# Altium project Main_PCB.PrjPcb
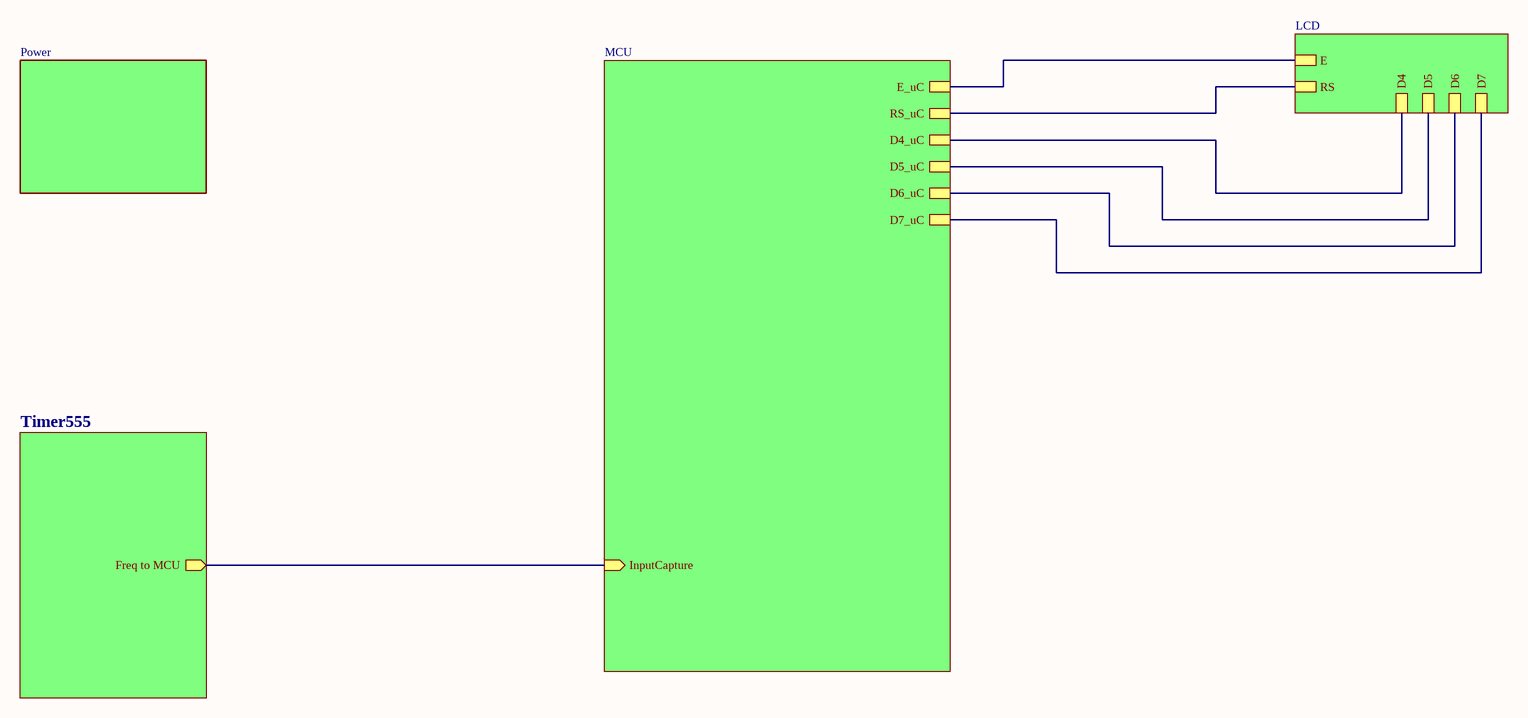
[diagram p0: Main_Board.SchDoc]
4 sheets, 65 parts. Net scope: hierarchical (ports join the sheet entries above them; power ports are global).
Board file: PCB4.PcbDoc
Sheets:
  Main_Board.SchDoc
    Power_D = Power.SchDoc
    Timer555_D = Timer555.SchDoc
    MCU_D = MCU.SchDoc

## Sheet Main_Board.SchDoc
size A3; SheetNumber: 1; SheetTotal: 5

### Sub-sheets
LCD_D = LCD (file not in this document): E, RS, D4, D5, D6, D7
MCU_D = MCU: E_uC, RS_uC, D4_uC, D5_uC, D6_uC, D7_uC, InputCapture (in)
Power_D = Power: no entries
Timer555_D = Timer555: Freq to MCU (out)

### Nets
PA0: sheet Timer555_D/Freq to MCU, sheet MCU_D/InputCapture
PB3: sheet MCU_D/E_uC, sheet LCD_D/E
PB4: sheet MCU_D/RS_uC, sheet LCD_D/RS
PB12: sheet MCU_D/D4_uC, sheet LCD_D/D4
PB13: sheet MCU_D/D5_uC, sheet LCD_D/D5
PB14: sheet MCU_D/D6_uC, sheet LCD_D/D6
PB15: sheet MCU_D/D7_uC, sheet LCD_D/D7

## Sheet Power.SchDoc
size A4; SheetNumber: 2; SheetTotal: 5
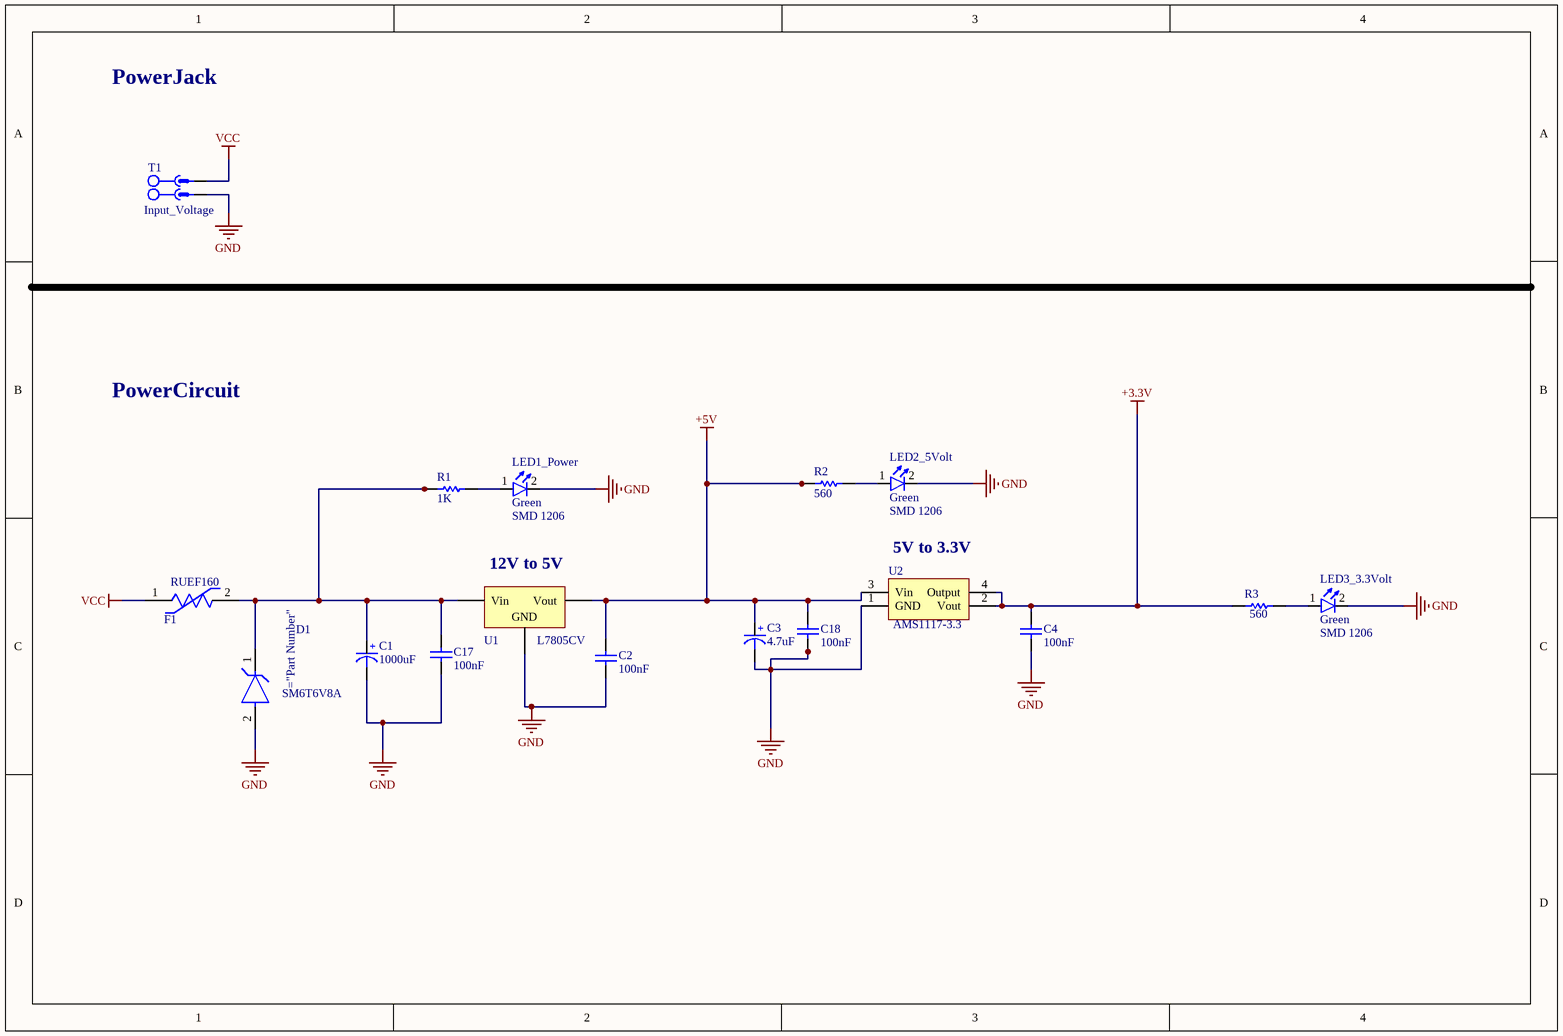
[diagram p1: Power.SchDoc]

### Parts
C1  1000uF  [cap 01]
C2  100nF  [CAPC3216L (1206)]
C3  4.7uF  [cap 01]
C4  100nF  [CAPC3216L (1206)]
C17  100nF  [CAPC3216L (1206)]
C18  100nF  [CAPC3216L (1206)]
D1  SM6T6V8A  [STMicroelectronics_SM6T6V8A_0]
F1  RUEF160  [Littelfuse_RUEF160]
LED1_Power  Size: SMD 1206  [LED SMD 1206]  (hidden comment: Green)
LED2_5Volt  Size: SMD 1206  [LED SMD 1206]  (hidden comment: Green)
LED3_3.3Volt  Size: SMD 1206  [LED SMD 1206]  (hidden comment: Green)
R1  1K  [RESC4817X04N]
R2  560  [RESC4817X04N]
R3  560  [RESC4817X04N]
T1  Input_Voltage  [MSTBV 2,5/2-G-5]
U1  L7805CV  [TO-220 AB]
U2  AMS1117-3.3  [SOT223-4N]

### Nets
+3.3V: C4.1(+) R3.1 U2.2(Vout) U2.4(Output)
+5V: C2.1(+) C3.1(+) C18.1(+) R2.1 U1.3(Vout) U2.3(Vin)
GND: C1.2(-) C2.2(-) C3.2(-) C4.2(-) C17.2(-) C18.2(-) D1.2(A) LED1_Power.2(K) LED2_5Volt.2(K) LED3_3.3Volt.2(K) T1.1 U1.2(GND) U2.1(GND)
VCC: F1.1 T1.2
NetC1_1: C1.1(+) C17.1(+) D1.1(K) F1.2 R1.1 U1.1(Vin)
NetLED1_Power_1: LED1_Power.1(A) R1.2
NetLED2_5Volt_1: LED2_5Volt.1(A) R2.2
NetLED3_3.3Volt_1: LED3_3.3Volt.1(A) R3.2

### Notes on the sheet
- PowerJack
- PowerCircuit
- (near U1) 12V to 5V
- 5V to 3.3V

### Library data of the parts
C1 C3 = CAP_Polar: Polar Capacitor; Designer: Eng. Saeid Jorablo; Company: SJ Libraries; Voltage: 16V; ComponentLink1Description: Datasheet; ComponentLink2Description: Reference; Publisher: SJ Unlimited; Mounting Technology: Surface Mount\Through-Hole; HelpURL: http://s3.picofile.com/file/7443264187/Coming_Soon_logo.gif; Status: Unreleased
  C1: Value: 1000uF
  C3: Value: 4.7uF
C2 C4 C17 C18 = CAP_Bipolar: Bipolar Capacitor; Voltage: 100V; Designer: Eng. Saeid Jorablo; Company: SJ Libraries; ComponentLink1Description: Datasheet; ComponentLink2Description: Reference; Publisher: SJ Unlimited; Mounting Technology: *; Mounting Technology: Surface Mount\Through-Hole; HelpURL: http://s3.picofile.com/file/7443264187/Coming_Soon_logo.gif; Status: Unreleased; Value: 100nF
D1 = SM6T6V8A: TVS DIODE 5.8VWM 13.4VC SMB
F1 = RUEF160: Littelfuse RUEF160----PTC Resettable Fuse 1.6A(hold) 3.2A(trip) 30V 100A 0.9W 8s 0.03Ohm Radial 8.9 X 3 X 15.2mm Bag
LED1_Power LED2_5Volt LED3_3.3Volt = LED: Designer: Saeid Jorablo; Organazation: ControTec; Adding Date: 1387/12/22; Color: Green
R1-R3 = RES 1206 0.25W: RES 1206; Designer: Abbas Basereh; Desc.: RES SMD 1206; Data: 16-12-2016
T1 = CON_Phoenix_MSTBV_02: 2 Pitch: 5 mm Color: green Contact surface: Tin Assembly; Manufacturer: PHOENIX CONTACT; PART.NO: 1753437; Connector type: PCB Terminal Block; designer: ABBAS BASEREH; Max Current: 12 A; Positions: 2; Voltage: 320 V; Category: Connector; ComponentLink1Description: Header, Nominal current: 12 A Rated voltage (III/2): 320 V Number of positions: 2 Pitch: 5 mm Color: green Contact surface: Tin Assembly: Soldering  DESIGNER:ABBAS BASEREH; ComponentLink2Description: Reference; Mounting Technology: Through-Hole; Pin Count: 2; Revision 1: 2017-3-1; Status: Unreleased
U1 = L7805CV-Linear Voltage Regulator IC Positive 1 Output 5V 1.5A TO-220AB: Linear Voltage Regulator IC Positive FIXED; Manufacturer: STMicroelectronics; Designer: Abbas Basereh; Link: https://www.aliexpress.com/item/; Link: http://www.tme.eu/en/; Link: http://www.digikey.com/; Part. No: L7805CV
U2 = IC_AMS1117-3.3: 800mA LOW DROPOUT VOLTAGE REGULATOR; Manufacturer: Advanced Monolithic Systems, Inc.; Company: SJ Libraries; Designer: Eng. Saeid Jorablo; ESD Sensetive: True/False; Code_IPC: SOT-223; ComponentLink1Description: Datasheet; ComponentLink1URL: http://www.advanced-monolithic.com/pdf/ds1117.pdf; ComponentLink2Description: Reference; ComponentLink2URL: http://www.advanced-monolithic.com/index.html; PackageDescription: SOT223, 4-Leads, Body 6.7x7.3mm (max), Pitch 2.30mm; PinCount: 4; Update: 6/5/2012; Category: Integrated Circuit; Status: Unrelease; HelpURL: http://s3.picofile.com/file/7443264187/Coming_Soon_logo.gif; Operating Temperature: -55 ~ +125 (C); Mounting Technology: Surface Mount; RoHS compliant: True/False

## Sheet Timer555.SchDoc
size A4; SheetNumber: 3; SheetTotal: 5
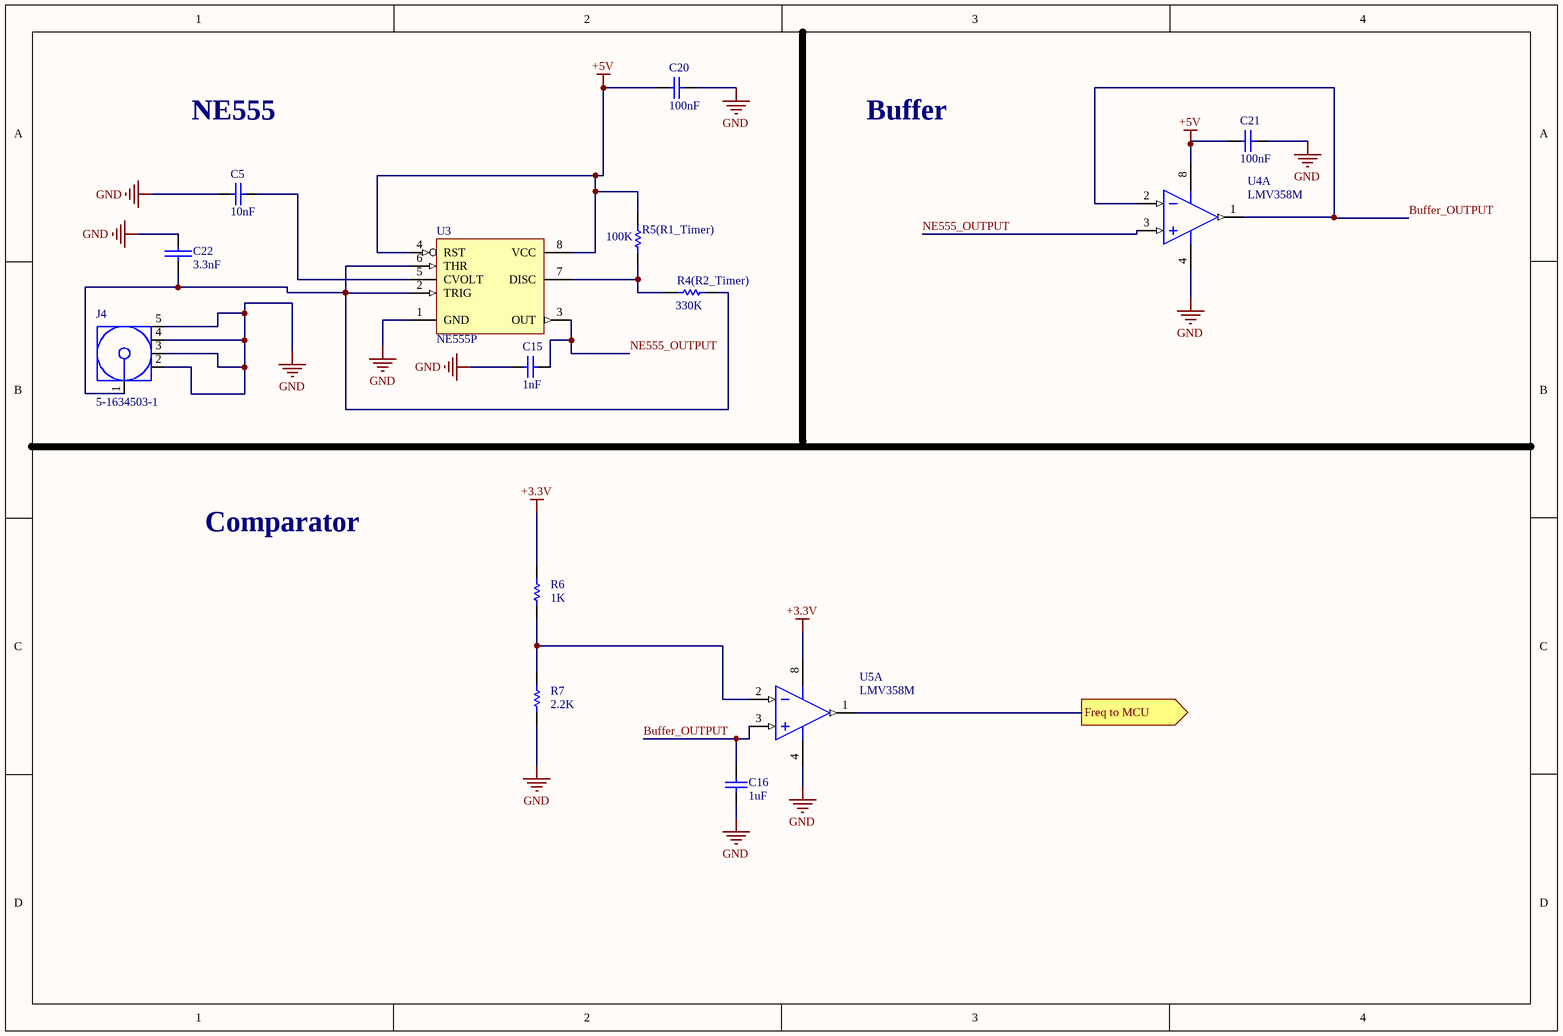
[diagram p2: Timer555.SchDoc]

### Parts
C5  10nF  [CAPC2012N (0805)]
C15  1nF  [CAPC3216M (1206)]
C16  1uF  [CAPC3216M (1206)]
C20  100nF  [CAPC2012N (0805)]
C21  100nF  [CAPC2012N (0805)]
C22  3.3nF  [Cap - 100nF]
J4  5-1634503-1  [TECO-5-1634503-1_V]
R4(R2_Timer)  330K  [Res-(1/2)]
R5(R1_Timer)  100K  [Res-(1/2)]
R6  1K  [RESC3216X60L (1206)]
R7  2.2K  [RESC3216X60L (1206)]
U3  NE555P  [P008]
U4  LMV358M  [M08A_M]  (part A of 2)
U5  LMV358M  [M08A_M]  (part A of 2)

### Ports
Freq to MCU (out)

### Nets
+3.3V: R6.2 U5.8(V+)
+5V: C20.1(+) C21.1(+) R5(R1_Timer).2 U3.4(RST) U3.8(VCC) U4.8(V+)
GND: C5.1(+) C15.1(+) C16.2(-) C20.2(-) C21.2(-) C22.1(+) J4.2 J4.3 J4.4 J4.5 R7.1 U3.1(GND) U4.4(V-) U5.4(V-)
Buffer_OUTPUT: C16.1(+) U4.1(OUTA) U4.2(INA-) U5.3(INA+)
NE555_OUTPUT: C15.2(-) U3.3(OUT) U4.3(INA+)
PA0: U5.1(OUTA) ; port Freq to MCU
NetC5_2: C5.2(-) U3.5(CVOLT)
NetC22_2: C22.2(-) J4.1 R4(R2_Timer).2 U3.2(TRIG) U3.6(THR)
NetR4(R2_Timer)_1: R4(R2_Timer).1 R5(R1_Timer).1 U3.7(DISC)
NetR6_1: R6.1 R7.2 U5.2(INA-)

### Notes on the sheet
- NE555
- Buffer
- Comparator

### Library data of the parts
C5 C15 C16 C20 C21 = CAP_Bipolar: as C2 on sheet Power; ComponentLink1Description: Datasheet; ComponentLink2Description: Reference; Publisher: SJ Unlimited; Mounting Technology: *; Mounting Technology: Surface Mount\Through-Hole; HelpURL: http://s3.picofile.com/file/7443264187/Coming_Soon_logo.gif; Status: Unreleased
  C5: Value: 10nF
  C15: Value: 1nF
  C16: Value: 1uF
  C20 C21: Value: 100nF
C22 = Cap-Bipolar: Bipolar Capacitor; Voltage: 100V; Designer: Saeid Jorablo; Organazation: ControTec; Adding Date: 1387/12/20; Value: 3.3nF
J4 = 5-1634503-1: Female Header, Pitch 3.13 mm, Height 13.7 mm, Tail Length 4.5 mm, -55 to 85 degC, RoHS, Bulk; Manufacturer: TE Connectivity; Coaxial Termination: Solder; Frequency Max: 2GHz; Connector Type: BNCCoaxial; SVHC: NoSVHC(15-Jun-2015); Connector Body Style: StraightJack; Impedance: 50ohm; Connector Mounting: PCBMount; Manufacturer URL: http://www.te.com/; Coaxial Cable Types: -; Datasheet Version: Rev. E, 02/2012; Datasheet URL: http://www.mouser.com/ds/2/418/NG_CD_1634503_E-657474.pdf; Product Range: -; Contact Plating: GoldPlatedContacts; Mounting Technology: ThroughHole; Contact Material: Brass; Package Description: Female Header, Pitch 3.13 mm, Height 13.7 mm, Tail Length 4.5 mm; Package Reference: 5-1634503-1; PartNumber: 5-1634503-1
R4(R2_Timer) R5(R1_Timer) R7 = RES: Resistor; Designer: Eng. Saeid Jorablo; Company: SJ Libraries; Tolerance: 5%; Power: 1/8 W; Value: 1K; Category: Resistors; ComponentLink1Description: Datasheet; ComponentLink2Description: Reference; PackageDescription: SMD & TH Resistors; Publisher: SJ Unlimited; Mounting Technology: Surface Mount\Through-Hole; HelpURL: http://s3.picofile.com/file/7443264187/Coming_Soon_logo.gif; Status: Unreleased
R6 = RES: Resistor; Designer: Eng. Saeid Jorablo; Company: SJ Libraries; Tolerance: 5%; Power: 1/8 W; Category: Resistors; ComponentLink1Description: Datasheet; ComponentLink2Description: Reference; PackageDescription: SMD & TH Resistors; Publisher: SJ Unlimited; Mounting Technology: Surface Mount\Through-Hole; HelpURL: http://s3.picofile.com/file/7443264187/Coming_Soon_logo.gif; Status: Unreleased; Value: 1K
U3 = NE555P: Precision Timer; Published: 16-Jan-2001; LatestRevisionDate: 04-Mar-2005; LatestRevisionNote: Stylized 3D Model Added.; DatasheetVersion: Feb-1992; PackageVersion: Jun-1999; PackageReference: P008; Publisher: Altium Limited; PackageDescription: DIP; 8 Leads; Row Spacing 7.62 mm; Pitch 2.54 mm; Code_JEDEC: MO-001-AN; ComponentLink1Description: Manufacturer Link; ComponentLink1URL: http://www.ti.com/; ComponentLink2Description: Datasheet; ComponentLink2URL: http://www-s.ti.com/sc/ds/ne555.pdf
U4 U5 = LMV358M: General Purpose, Low Voltage, Rail-to-Rail Output Operational Amplifiers, 8-pin Narrow SOIC; Manufacturer: National Semiconductor; PackageTopMarking: NSZXTT*LMV*358M; PowerWise: N; PinCount: 8; DatasheetVersion: Sep-2009; Code_JEDEC: MS-012-AA; Code_IPC: SOIC127P600-8; PackageVersion: revM, May-2009; PackageReference: M08A; PackageDescription: SOIC Narrow, 4.9 x 3.9 x 1.45mm, 8 Lead, 1.27mm Pitch; CompType: Amplifiers; RoHS: N; PartNumber: LMV358M

## Sheet MCU.SchDoc
size A3; SheetNumber: 4; SheetTotal: 5
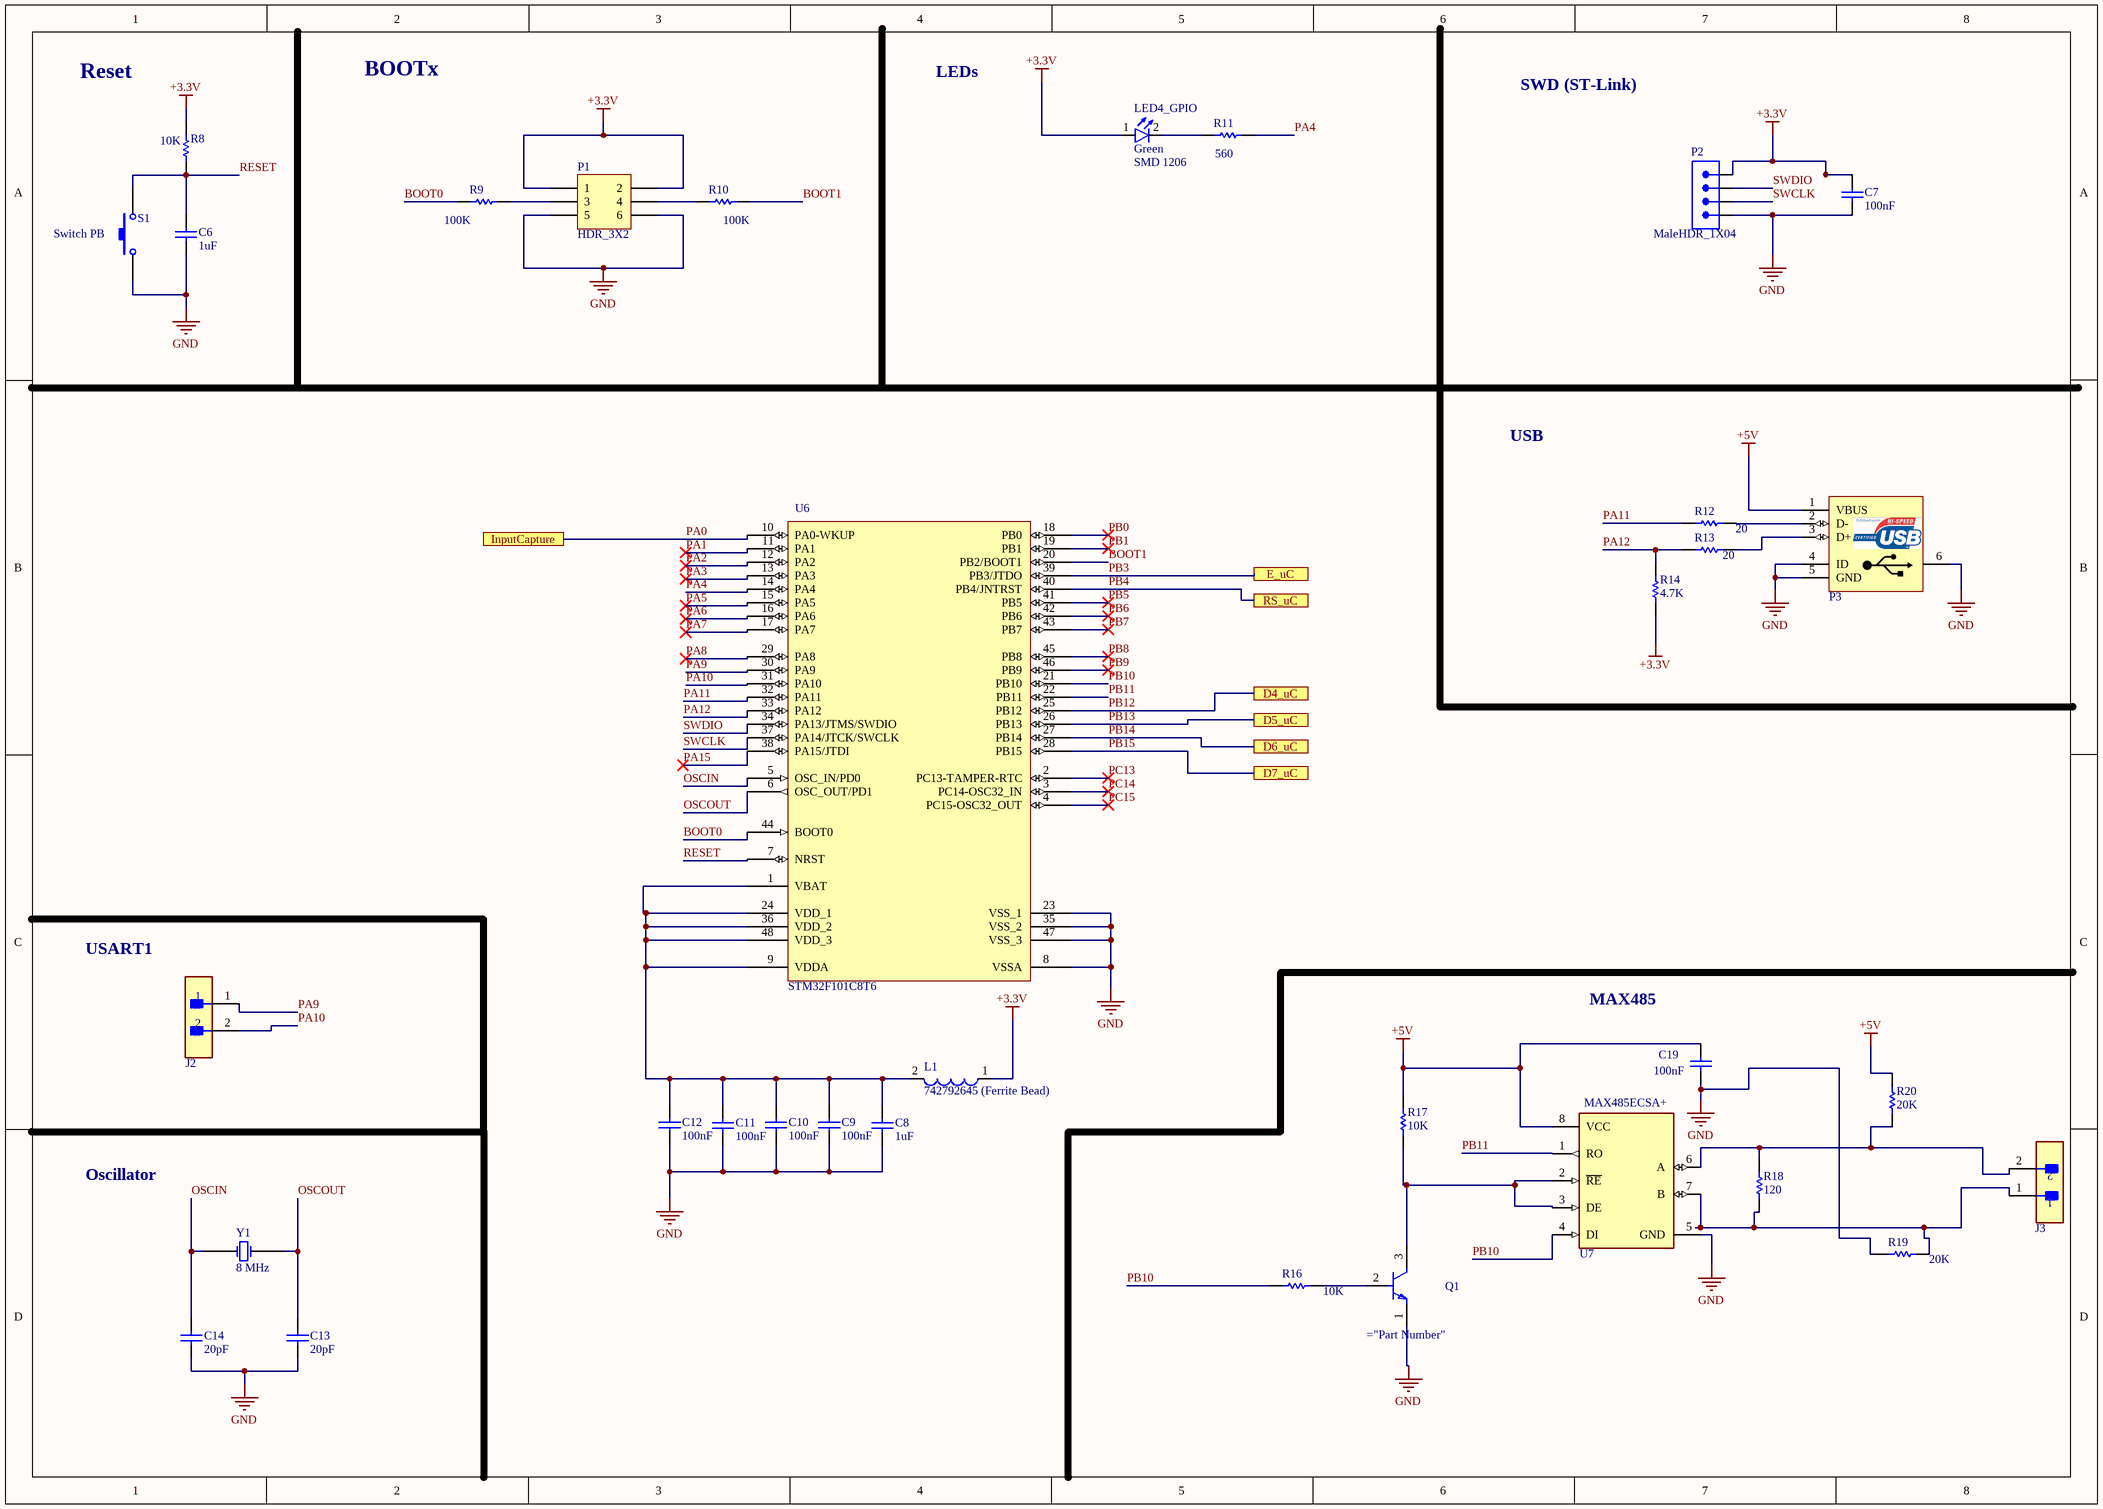
[diagram p3: MCU.SchDoc]

### Parts
C6  1uF  [CAPC3216L (1206)]
C7  100nF  [CAPC3216L (1206)]
C8  1uF  [Cap - 100nF]
C9  100nF  [CAPC3216M (1206)]
C10  100nF  [CAPC3216M (1206)]
C11  100nF  [CAPC3216M (1206)]
C12  100nF  [CAPC3216M (1206)]
C13  20pF  [CAPC1608M (0603)]
C14  20pF  [CAPC1608M (0603)]
C19  100nF  [CAPC3216M (1206)]
J2  B2B-XH-A_LF_SN  [JST_0_MFG]  (value not drawn)
J3  B2B-XH-A_LF_SN  [JST_0_MFG]  (value not drawn)
L1  742792645 (Ferrite Bead)  [SMD-0603]
LED4_GPIO  Size: SMD 1206  [LED SMD 1206]  (hidden comment: Green)
P1  HDR_3X2  [MISC_HDR_2X3]
P2  MaleHDR_1X04  [MHDR1X04-254P]
P3  USB Connector  [USB_AB_BM_SHS]  (value not drawn)
Q1  2N3904TF  [ON_Semiconductor_135AR_MFG]  (value not drawn)
R8  10K  [RESC3216X60L (1206)]
R9  100K  [RESC3216X60M (1206)]
R10  100K  [RESC3216X60M (1206)]
R11  560  [RESC3216X60M (1206)]
R12  20  [RESC3216X60M (1206)]
R13  20  [RESC3216X60M (1206)]
R14  4.7K  [RESC3216X60M (1206)]
R16  10K  [RESC3216X60M (1206)]
R17  10K  [RESC3216X60M (1206)]
R18  120  [RESC3216X60M (1206)]
R19  20K  [RESC3216X60M (1206)]
R20  20K  [RESC3216X60M (1206)]
S1  Switch PB  [Switch - Push to On]
U6  STM32F101C8T6  [LQFP48_L]
U7  MAX485ECSA+  [Maxim_Integrated_S8-5_MFG]
Y1  8 MHz  [Crystal SMD]

### Ports
D4_uC, D5_uC, D6_uC, D7_uC, E_uC, InputCapture, RS_uC

### Nets
+3.3V: C7.1(+) L1.1 LED4_GPIO.1(A) P1.1 P1.2 P2.4 R8.2 R14.1
+5V: C19.2(-) P3.1(VBUS) R17.2 R20.2 U7.8(VCC)
GND: C6.2(-) C7.2(-) C8.2(-) C9.2(-) C10.2(-) C11.2(-) C12.2(-) C13.2(-) C14.2(-) C19.1(+) P1.5 P1.6 P2.1 P3.4(ID) P3.5(GND) P3.6(MH) Q1.1(E) R19.1 S1.1 U6.8(VSSA) U6.23(VSS_1) U6.35(VSS_2) U6.47(VSS_3) U7.5(GND)
BOOT0: R9.1 U6.44(BOOT0)
BOOT1: R10.2 U6.20(PB2/BOOT1)
OSCIN: C14.1(+) U6.5(OSC_IN/PD0) Y1.1(OSC1)
OSCOUT: C13.1(+) U6.6(OSC_OUT/PD1) Y1.2(OSC2)
PA0: U6.10(PA0-WKUP) ; port InputCapture
PA1: U6.11(PA1)
PA2: U6.12(PA2)
PA3: U6.13(PA3)
PA4: R11.2 U6.14(PA4)
PA5: U6.15(PA5)
PA6: U6.16(PA6)
PA7: U6.17(PA7)
PA8: U6.29(PA8)
PA9: J2.1 U6.30(PA9)
PA10: J2.2 U6.31(PA10)
PA11: R12.1 U6.32(PA11)
PA12: R13.1 R14.2 U6.33(PA12)
PA15: U6.38(PA15/JTDI)
PB0: U6.18(PB0)
PB1: U6.19(PB1)
PB3: U6.39(PB3/JTDO) ; port E_uC
PB4: U6.40(PB4/JNTRST) ; port RS_uC
PB5: U6.41(PB5)
PB6: U6.42(PB6)
PB7: U6.43(PB7)
PB8: U6.45(PB8)
PB9: U6.46(PB9)
PB10: R16.1 U6.21(PB10) U7.4(DI)
PB11: U6.22(PB11) U7.1(RO)
PB12: U6.25(PB12) ; port D4_uC
PB13: U6.26(PB13) ; port D5_uC
PB14: U6.27(PB14) ; port D6_uC
PB15: U6.28(PB15) ; port D7_uC
PC13: U6.2(PC13-TAMPER-RTC)
PC14: U6.3(PC14-OSC32_IN)
PC15: U6.4(PC15-OSC32_OUT)
RESET: C6.1(+) R8.1 S1.2 U6.7(NRST)
SWCLK: P2.2 U6.37(PA14/JTCK/SWCLK)
SWDIO: P2.3 U6.34(PA13/JTMS/SWDIO)
NetC8_1: C8.1(+) C9.1(+) C10.1(+) C11.1(+) C12.1(+) L1.2 U6.1(VBAT) U6.9(VDDA) U6.24(VDD_1) U6.36(VDD_2) U6.48(VDD_3)
NetJ3_1: J3.1 R18.1 R19.2 U7.7(B)
NetJ3_2: J3.2 R18.2 R20.1 U7.6(A)
NetLED4_GPIO_2: LED4_GPIO.2(K) R11.1
NetP1_3: P1.3 R9.2
NetP1_4: P1.4 R10.1
NetP3_2: P3.2(D-) R12.2
NetP3_3: P3.3(D+) R13.2
NetQ1_2: Q1.2(B) R16.2
NetQ1_3: Q1.3(C) R17.1 U7.2(~{RE}) U7.3(DE)

### Notes on the sheet
- Reset
- BOOTx
- LEDs
- SWD (ST-Link)
- USB
- USART1
- MAX485
- Oscillator
- (in symbol USB AB MICRO CONNECTOR) D:AbbasBasereh

### Library data of the parts
C6-C14 C19 = CAP_Bipolar: as C2 on sheet Power; ComponentLink1Description: Datasheet; ComponentLink2Description: Reference; Publisher: SJ Unlimited; Mounting Technology: *; Mounting Technology: Surface Mount\Through-Hole; HelpURL: http://s3.picofile.com/file/7443264187/Coming_Soon_logo.gif; Status: Unreleased
  C6 C8: Value: 1uF
  C7 C9-C12 C19: Value: 100nF
  C13 C14: Value: 20pF
L1 = 742792645: SMD EMI Suppression Ferrite Bead WE-CBF, Z = 470 Ohm; Impedance: 470 Ohm; DatasheetVersion: ver 1, Aug-2009; PackageVersion: 2009; PackageReference: SMD-0603; PackageDescription: Chip Inductor, 2-Leads, Body 1.6 x 0.8 mm; ComponentLink1Description: Manufacturer URL; ComponentLink1URL: http://www.we-online.com; ComponentLink2Description: Datasheet; ComponentLink2URL: http://www.we-online.de/katalog/media/pdf/742792645.pdf
LED4_GPIO = LED: as LED1_Power on sheet Power; Adding Date: 1387/12/22; Color: Green
P1 = HDR_3X2: Header, 3-Pin, Dual row; designer: Eng. Saeid Jorablo; Company: SJ Libraries; Max Current: mA; LatestRevisionDate: 17-Jul-2002; Publisher: SJ UnLimited; Mounting Technology: Through-Hole; Category: Headers; Pin Count: 6; Status: Unreleased; ComponentLink1Description: Datasheet; ComponentLink2Description: Reference; Update: 7/8/2012; HelpURL: http://s3.picofile.com/file/7443264187/Coming_Soon_logo.gif
P2 = MHDR_1X04: Male Header 1X04
P3 = USB AB MICRO CONNECTOR: USB MICRO-B Type Connector; Designer: ABBAS BASEREH; Max Current: 1600mA; Mounting Technology: Surface Mount\Through-Hole; Category: Connector; Pin Count: 5-7; Publisher: ABBAS BASEREH; Status: Unreleased; ComponentLink1Description: Datasheet; ComponentLink2Description: Reference; Update: 1395-11-17
R8-R14 R16-R20 = RES: as R4(R2_Timer) on sheet Timer555; Category: Resistors; ComponentLink1Description: Datasheet; ComponentLink2Description: Reference; PackageDescription: SMD & TH Resistors; Publisher: SJ Unlimited; Mounting Technology: Surface Mount\Through-Hole; HelpURL: http://s3.picofile.com/file/7443264187/Coming_Soon_logo.gif; Status: Unreleased
S1 = Switch PB: Push Button Switch
U6 = STM32F101C8T6: STM32 ARM-based 32-bit MCU with 64 Kbytes Flash, 48-pin LQFP, Industrial Temperature; Published: 30-May-2008; DatasheetVersion: rev6, Mar-2008; PackageVersion: Mar-2008; PackageReference: LQFP48; Publisher: Altium Limited; PackageDescription: 48-Pin Low-Profile Quad Flat Pack, 7 x 7 mm Body, 0.5 mm Pitch (LQFP48); ComponentLink1Description: Manufacturer Link; ComponentLink1URL: www.st.com/stm32; ComponentLink2Description: Datasheet; ComponentLink2URL: http://www.st.com/stonline/products/literature/ds/13586.pdf
Y1 = XTAL_Crystal: XTAL Crystal; Designer: ABBAS BASEREH; Value: 12 MHz; Design Date: 2017-1-3; ComponentLink1Description: Datasheet; ComponentLink2Description: Reference; Mounting Technology: Surface Mount\Through-Hole; Status: Unreleased

## Nets that join several sheets
+3.3V: Power (C4.1 R3.1 U2.2 U2.4), Timer555 (R6.2 U5.8), MCU (8 pins)
+5V: Power (6 pins), Timer555 (6 pins), MCU (5 pins)
GND: Power (13 pins), Timer555 (14 pins), MCU (24 pins)
PA0: Timer555 (U5.1), MCU (U6.10)